# Altium schematic sheet HV-Measurement.SchDoc
size A4; SheetNumber: 6
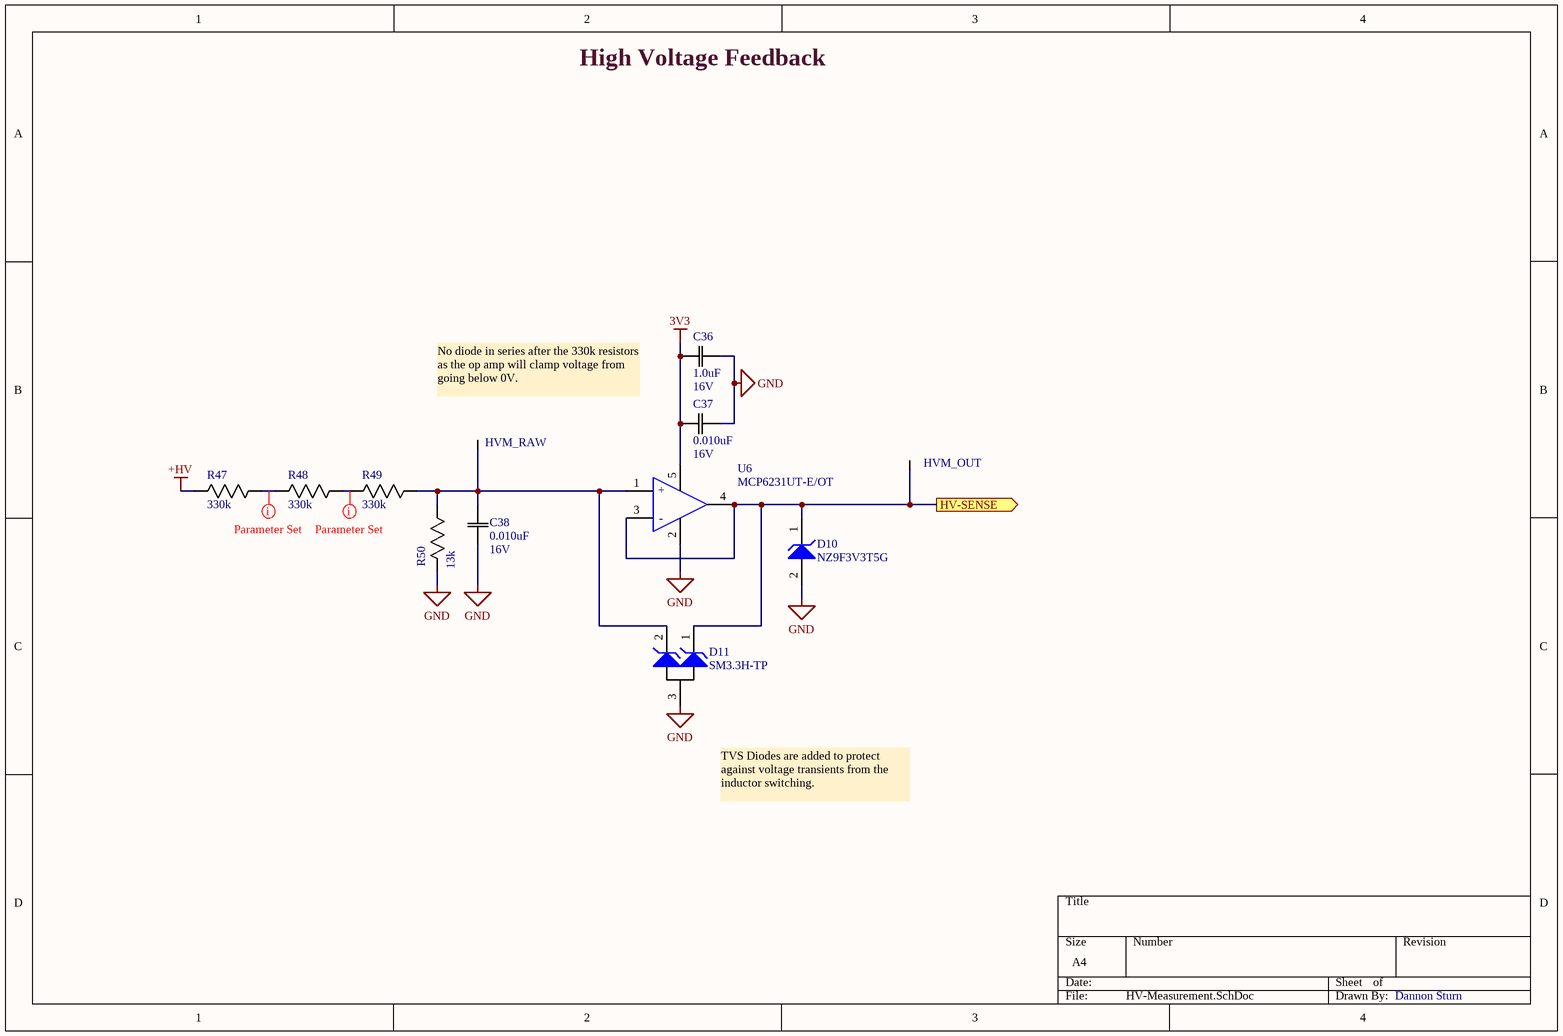
[diagram p0: HV-Measurement.SchDoc]

## Parts
C36  Rating: 16V  [0603]  (hidden comment: 1.0uF)
C37  Rating: 16V  [0603]  (hidden comment: 0.010uF)
C38  Rating: 16V  [0603]  (hidden comment: 0.010uF)
D10  NZ9F3V3T5G  [SOD-923_0P6X0P85_ONS]
D11  SM3.3H-TP  [SOT-23A-3]
HVM_OUT  Test Point (Via)  [TP]  (value not drawn)  (no BOM)
HVM_RAW  Test Point (Via)  [TP]  (value not drawn)  (no BOM)
R47  330k  [0603]
R48  330k  [0603]
R49  330k  [0603]
R50  13k  [0603]
U6  MCP6231UT-E/OT  [SOT-23-5_MC_MCH-L]

## Ports
HV-SENSE (out)

## Nets
3V3: C36.2(C2) C37.1(C1) U6.5(V+)
+HV: R47.2(R2)
GND: C36.1(C1) C37.2(C2) C38.1(C1) D10.2(A) D11.3 R50.2(R2) U6.2(V-)
HV-SENSE: D10.1(K) D11.1 HVM_OUT.1 U6.3(IN-) U6.4(OUT) ; port HV-SENSE
NetC38_2: C38.2(C2) D11.2 HVM_RAW.1 R49.1(R1) R50.1(R1) U6.1(IN+)
NetR47_1: R47.1(R1) R48.2(R2)
NetR48_1: R48.1(R1) R49.2(R2)

## Layout directives
net class HighVoltage: NetR47_1, NetR48_1

## Notes on the sheet
- High Voltage Feedback
- No diode in series after the 330k resistors as the op amp will clamp voltage from going below 0V.
- TVS Diodes are added to protect against voltage transients from the inductor switching.
- Dannon Sturn
- (in symbol OP AMP MCP6231UT-E_OT) +; -

## Library data of the parts
C36 = CAP 1.0uF 16V: CAP CER 1.0UF 16V X5R 0603/0805; Tolerance: 10%; Package: 0603/0805; Temperature Coefficient: X5R; Operating Temperature: -55°C ~ 85°C; Value: 1.0uF; Part Number: CAP 1.0uF 16V
C37 C38 = CAP 0.010uF 16V: CAP CER 0.010UF 16V X5R 0603; Tolerance: 10%; Temperature Coefficient: X5R; Value: 0.010uF; Part Number: CAP 0.010uF 16V; Package: 0603/0805; Operating Temperature: -55°C ~ 85°C
D10 = DIODE ZENER 3.3 200mW: Zener Diode 3.3 V 200 mW ±5% Surface Mount SOD-923; Mfr_Name: ON Semiconductor; Type: DEV; Copyright: Copyright (C) 2021 Ultra Librarian. All rights reserved.; Manufacturer_Part_Number: NZ9F3V3T5G; Digi-Key_Part_Number_1: NZ9F3V3T5GOSTR-ND; Digi-Key_Part_Number_2: NZ9F3V3T5GOSCT-ND; Digi-Key_Part_Number_3: NZ9F3V3T5GOSDKR-ND; RefDes: RefDes; Supplier 1: Digi-Key; Supplier Part Number 1: NZ9F3V3T5GOSCT-ND; Part Number: DIODE ZENER 3.3 200mW; Manufacturer Part Number 1: NZ9F3V3T5G; Supplier URL 1: https://www.digikey.com/en/products/detail/onsemi/NZ9F3V3T5G/1961325
D11 = DIODE TVS 3.3VR 3.5VBR: 3.3V Reverese Standoff, 3.5V Breakdown, 12.5V Clamp 40A (8/20µs) Ipp Tvs Diode SMD SOT-23; ComponentLink1Description: Octopart Link; ComponentLink1URL: https://octopart.com/search?q=SM3.3H-TP&currency=USD&specs=0; Part Number: DIODE TVS 3.3VR 3.5VBR; Manufacturer Part Number 1: SM3.3H-TP; Supplier 1: Digi-Key; Supplier Part Number 1: 353-SM3.3H-TPCT-ND; Supplier URL 1: https://www.digikey.com/en/products/detail/micro-commercial-co/SM3-3H-TP/12177181
R47-R49 = RES 330k 1/8W - 1%: RES SMD 274K OHM 1% 1/8W 0603; Part Number: RES 330k 1/8W - 1%
R50 = RES 13k 1/8W: RES SMD 13K OHM 5% 1/8W 0603; Power (Watts): 0.125W; Package: 0805; Value: 13k; Tolerance: 5%; Part Number: RES 13k 1/8W
U6 = OP AMP MCP6231UT-E_OT: Mfr_Name: Microchip; Copyright: Copyright (C) 2021 Ultra Librarian. All rights reserved.; Manufacturer_Part_Number: MCP6231UT-E/OT; Digi-Key_Part_Number_1: MCP6231UT-E/OTCT-ND; Digi-Key_Part_Number_2: MCP6231UT-E/OTDKR-ND; Digi-Key_Part_Number_3: MCP6231UT-E/OTTR-ND; RefDes: RefDes; Type: DEV; Supplier 1: Digi-key; Supplier Part Number 1: MCP6231UT-E/OTCT-ND; Part Number: OP AMP MCP6231UT-E_OT; Manufacturer Part Number 1: MCP6231UT-E/OT; Supplier URL 1: https://www.digikey.ca/en/products/detail/microchip-technology/MCP6231UT-E-OT/716023
HVM_OUT HVM_RAW = Test Point (Via): Part Number: Test Point (Via)